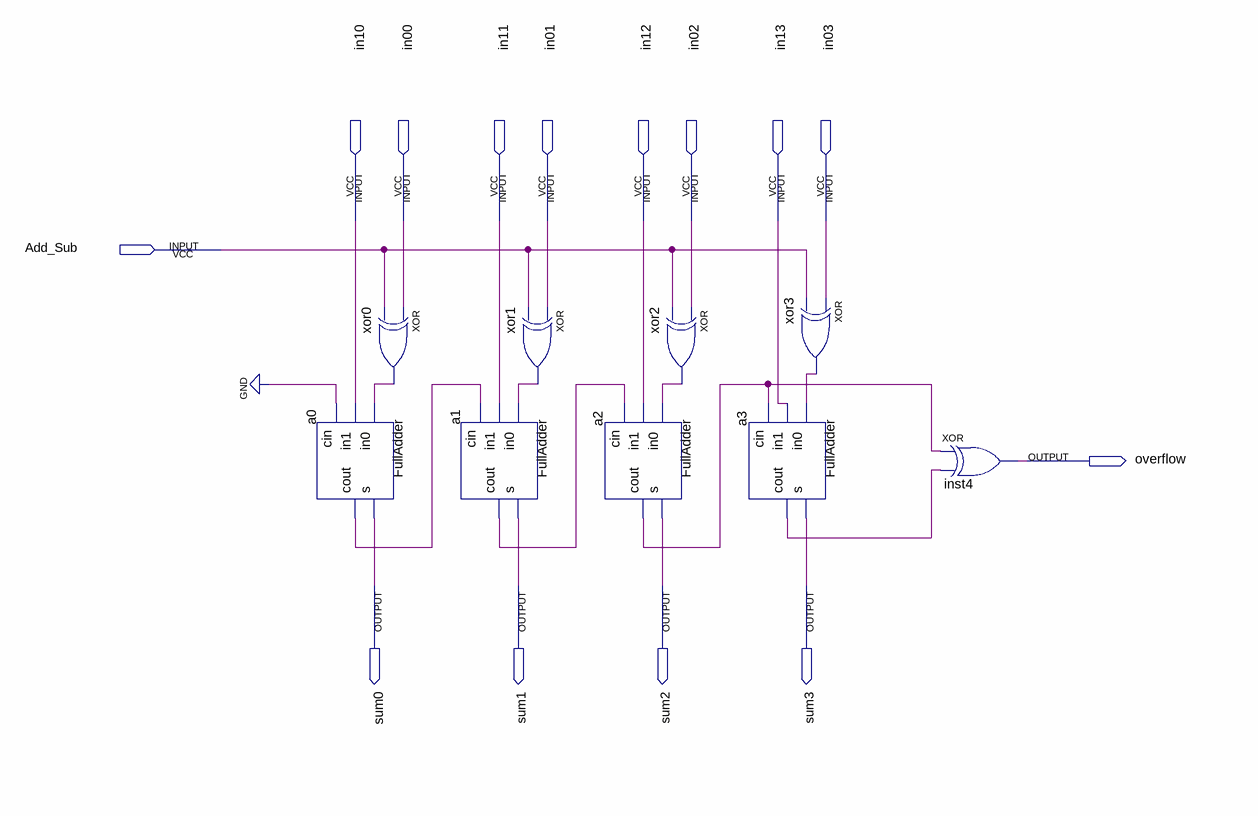
[diagram p0: schematic sheet]
// Quartus schematic AddSub4.bdf as structural Verilog: 9 symbols, 14 pins
module AddSub4 (
  input  in10,
  input  in00,
  input  in11,
  input  in01,
  input  in12,
  input  in02,
  input  in13,
  input  in03,
  input  Add_Sub,
  output overflow,
  output sum0,
  output sum1,
  output sum2,
  output sum3
);

  wire a0_cout, a1_cout, a2_cout, a3_cout, xor0_out, xor1_out, xor2_out, xor3_out;

  FullAdder a0 (.in0(xor0_out), .in1(in10), .cin(1'b0), .s(sum0), .cout(a0_cout));
  xor xor0 (xor0_out, in00, Add_Sub);
  FullAdder a1 (.in0(xor1_out), .in1(in11), .cin(a0_cout), .s(sum1), .cout(a1_cout));
  xor xor1 (xor1_out, in01, Add_Sub);
  FullAdder a2 (.in0(xor2_out), .in1(in12), .cin(a1_cout), .s(sum2), .cout(a2_cout));
  xor xor2 (xor2_out, in02, Add_Sub);
  xor xor3 (xor3_out, in03, Add_Sub);
  FullAdder a3 (.in0(xor3_out), .in1(in13), .cin(a2_cout), .s(sum3), .cout(a3_cout));
  xor inst4 (overflow, a2_cout, a3_cout);
endmodule
